# Altium project DARKYDEN.PrjPcb (part 6 of 15)

## Sheet POWER_PCie.SchDoc: DARKYDEN_POWERPCie
size Letter; ApprovedBy: APPROUVÉ PAR; Author: Harold Malbrouck; Organization: Cegep Limoilou; Address1: 1300, 8e Avenue; Address2: Québec, QC; Address3: Canada; Address4: G1J 5L5; Revision: Rev.A; SheetNumber: 6; SheetTotal: 22
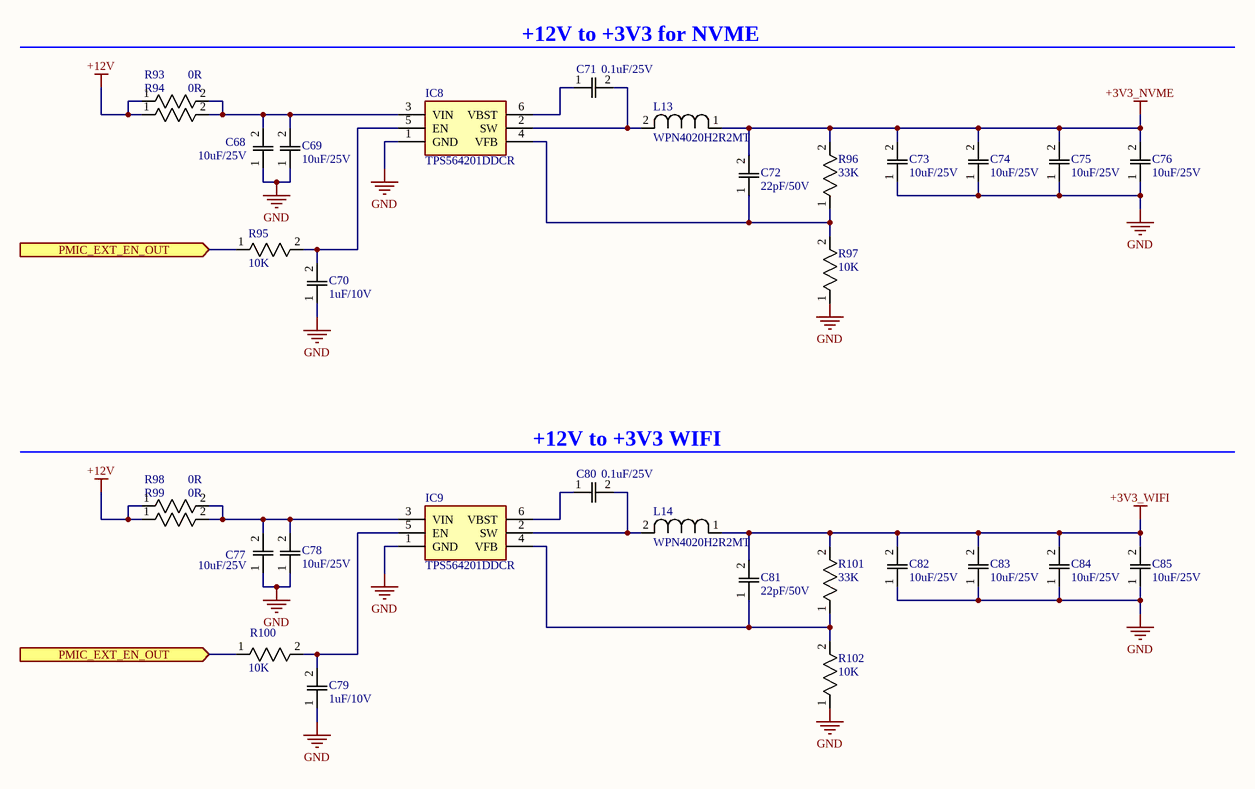
[diagram p5: POWER_PCie.SchDoc]

### Parts
C68  10uF/25V  [CAPC220145_88N_KEM]
C69  10uF/25V  [CAPC220145_88N_KEM]
C70  1uF/10V  [CAPC220145_88N_KEM]
C71  0.1uF/25V  [CAPC220145_88N_KEM]
C72  22pF/50V  [CAPC220145_88N_KEM]
C73  10uF/25V  [CAPC220145_88N_KEM]
C74  10uF/25V  [CAPC220145_88N_KEM]
C75  10uF/25V  [CAPC220145_88N_KEM]
C76  10uF/25V  [CAPC220145_88N_KEM]
C77  10uF/25V  [CAPC220145_88N_KEM]
C78  10uF/25V  [CAPC220145_88N_KEM]
C79  1uF/10V  [CAPC220145_88N_KEM]
C80  0.1uF/25V  [CAPC220145_88N_KEM]
C81  22pF/50V  [CAPC220145_88N_KEM]
C82  10uF/25V  [CAPC220145_88N_KEM]
C83  10uF/25V  [CAPC220145_88N_KEM]
C84  10uF/25V  [CAPC220145_88N_KEM]
C85  10uF/25V  [CAPC220145_88N_KEM]
IC8  TPS564201DDCR  [SOT95P280X110-6N]
IC9  TPS564201DDCR  [SOT95P280X110-6N]
L13  WPN4020H2R2MT  [IND_WPN4020H_SNL]
L14  WPN4020H2R2MT  [IND_WPN4020H_SNL]
R93  0R  [ERJ3EKF1000V]
R94  0R  [ERJ3EKF1000V]
R95  10K  [ERJ3EKF1000V]
R96  33K  [ERJ3EKF1000V]
R97  10K  [ERJ3EKF1000V]
R98  0R  [ERJ3EKF1000V]
R99  0R  [ERJ3EKF1000V]
R100  10K  [ERJ3EKF1000V]
R101  33K  [ERJ3EKF1000V]
R102  10K  [ERJ3EKF1000V]

### Ports
PMIC_EXT_EN_OUT (in, see CONNECTEUR_1[1B], Power[1A], Power[1C], POWER_PCie[1B]), PMIC_EXT_EN_OUT (in, see CONNECTEUR_1[1B], Power[1A], Power[1C], POWER_PCie[1C])

### Nets
+3V3_NVME: C72.2 C73.2 C74.2 C75.2 C76.2 L13.1 R96.2
+3V3_WIFI: C81.2 C82.2 C83.2 C84.2 C85.2 L14.1 R101.2
+12V: R93.1 R94.1 R98.1 R99.1  [project net Vout]
GND: C68.1 C69.1 C70.1 C73.1 C74.1 C75.1 C76.1 C77.1 C78.1 C79.1 C82.1 C83.1 C84.1 C85.1 IC8.1(GND) IC9.1(GND) R97.1 R102.1  [project net PACK-]
PMIC_EXT_EN_OUT: R95.1 R100.1 ; port PMIC_EXT_EN_OUT
NetC68_2: C68.2 C69.2 IC8.3(VIN) R93.2 R94.2
NetC70_2: C70.2 IC8.5(EN) R95.2
NetC71_1: C71.1 IC8.6(VBST)
NetC71_2: C71.2 IC8.2(SW) L13.2
NetC72_1: C72.1 IC8.4(VFB) R96.1 R97.2
NetC77_2: C77.2 C78.2 IC9.3(VIN) R98.2 R99.2
NetC79_2: C79.2 IC9.5(EN) R100.2
NetC80_1: C80.1 IC9.6(VBST)
NetC80_2: C80.2 IC9.2(SW) L14.2
NetC81_1: C81.1 IC9.4(VFB) R101.1 R102.2

### Notes on the sheet
- (near C71) +12V to +3V3 for NVME
- (near C80) +12V to +3V3 WIFI
- Titre :
- Conception :
- Date :
- Approbation :
- Heure :
- Révision :
- Feuille
- de
- Fichier :

### Library data of the parts
C68 C69 C73-C78 C82-C85 = C0805C106K3PACTU: 10uF / 25 VDC, +85degC, X5R Dielec, +/-10% | KEMET C0805C106K3PACTU 0805; Dielectric Material: Ceramic; Material: 4241ConductorMaterial; Voltage Rating: 25V; Dissipation Factor: 10%; Mfr_Name: Kemet; Supplier: Digikey; Supplier Part Number: 399-11939-1-ND; Manufacturer: KEMET; Manufacturer Part Number: C0805C106K3PACTU; RoHS: Yes; Category: Ceramic Capacitors; Case/Package: 0805; Case Code (Metric): 2012; Case Code (Imperial): 0805; Min Operating Temperature: -55°C; Max Operating Temperature: 85°C; Dielectric: X5R; Packaging: Cut Tape; Voltage: 25V; Termination: Solder; Tolerance: 10%; Value: 10uF; Series: SMD Comm X5R; Voltage Rating (DC): 25V; Length: 2mm; Height: 1.25mm; Depth: 1.25mm; Reach SVHC Compliant: No; RoHS Compliant: Yes; Lead Free: 5697LeadFree; ComponentLink1URL: http://www.farnell.com/datasheets/2741185.pdf?src-supplier=Farnell; ComponentLink1Description: http://www.farnell.com/datasheets/2741185.pdf?src-supplier=Farnell; ComponentLink2URL: http://www.alliedelec.com/m/d/f3c02ddb98afa3dd1adcb801109671e9.pdf?src-supplier=Allied+Electronics; ComponentLink2Description: http://www.alliedelec.com/m/d/f3c02ddb98afa3dd1adcb801109671e9.pdf?src-supplier=Allied+Electronics; ComponentLink3URL: https://api.kemet.com/component-edge/download/datasheet/C0805C106K3PAC7800.pdf?src-supplier=Digikey; ComponentLink3Description: https://api.kemet.com/component-edge/download/datasheet/C0805C106K3PAC7800.pdf?src-supplier=Digikey; ComponentLink4URL: http://www.kemet.com/Lists/ProductCatalog/Attachments/19/KEM_C1006_X5R_SMD.pdf?src-supplier=Avnet; ComponentLink4Description: http://www.kemet.com/Lists/ProductCatalog/Attachments/19/KEM_C1006_X5R_SMD.pdf?src-supplier=Avnet; ComponentLink5URL: http://www.farnell.com/datasheets/2741185.pdf?src-supplier=Element14; ComponentLink5Description: http://www.farnell.com/datasheets/2741185.pdf?src-supplier=Element14; ComponentLink6URL: http://www.farnell.com/datasheets/2741185.pdf?src-supplier=Newark; ComponentLink6Description: http://www.farnell.com/datasheets/2741185.pdf?src-supplier=Newark; ComponentLink7URL: https://datasheet.octopart.com/C0805C106K3PACTU-Kemet-datasheet-46909776.pdf?src-supplier=Element14; ComponentLink7Description: https://datasheet.octopart.com/C0805C106K3PACTU-Kemet-datasheet-46909776.pdf?src-supplier=Element14
C70 C79 = C0805C105K8RACTU: Multilayer Ceramic Capacitors MLCC - SMD/SMT 10V 1uF X7R 0805 10%; Mfr_Name: Kemet; Material: 4241ConductorMaterial; Dissipation Factor: 5%; Supplier: Digikey; Supplier Part Number: 399-C0805C105K8RACTUCT-ND; Manufacturer: KEMET; Manufacturer Part Number: C0805C105K8RACTU; RoHS: Yes; Category: Ceramic Capacitors; Stock: 113387; Pricing: 1=0.2, 10=0.112, 100=0.0701, 1000=0.04837 (USD); Mounting Technology: Surface Mount; Case/Package: 0805; Pins: 2NUMBER; Case Code (Imperial): 0805; Case Code (Metric): 2012; Dielectric Material: Ceramic; Min Operating Temperature: -55°C; Max Operating Temperature: 125°C; Packaging: Tape and Reel; Tolerance: 10%; Value: 1uF; Dielectric: X7R; Package Quantity: 1; Voltage Rating: 10V; Voltage Rating (DC): 10V; Termination: SMD/SMT; Voltage: 10V; Series: C; Construction: Flat; Length: 2mm; Width: 0.049inch; Height: 0.9mm; Depth: 1.25mm; Thickness: 0.039inch; Lead Pitch: 0.75mm; Radiation Hardening: No; Reach SVHC Compliant: No; RoHS Compliant: Yes; Lead Free: 5697LeadFree; ComponentLink1URL: https://datasheet.ciiva.com/6074/kem-c1002-x7r-smd-6074662.pdf?src-supplier=Farnell; ComponentLink1Description: https://datasheet.ciiva.com/6074/kem-c1002-x7r-smd-6074662.pdf?src-supplier=Farnell; ComponentLink2URL: https://datasheet.ciiva.com/22749/1918693-22749723.pdf?src-supplier=Element14; ComponentLink2Description: https://datasheet.ciiva.com/22749/1918693-22749723.pdf?src-supplier=Element14; ComponentLink3URL: https://datasheet.ciiva.com/46385/1851736-46385656.pdf?src-supplier=Element14; ComponentLink3Description: https://datasheet.ciiva.com/46385/1851736-46385656.pdf?src-supplier=Element14; ComponentLink4URL: https://datasheet.ciiva.com/46443/1851736-46443534.pdf?src-supplier=Element14; ComponentLink4Description: https://datasheet.ciiva.com/46443/1851736-46443534.pdf?src-supplier=Element14
C71 C80 = C0805C104K3RACTU: 0.1uF 25V X7R 10% SMD 0805 125C Plastic T/R; Mfr_Name: Kemet; Material: 4241ConductorMaterial; Value: 100nF; Temperature Coefficient: 30ppm/°C; Supplier: Digikey; Supplier Part Number: 399-C0805C104K3RACTUCT-ND; Manufacturer: KEMET; Manufacturer Part Number: C0805C104K3RACTU; RoHS: Yes; Category: Ceramic Capacitors; Mounting Technology: Surface Mount,PCB; Case/Package: 0805; Pins: 2NUMBER; Case Code (Imperial): 0805; Case Code (Metric): 2012; Min Operating Temperature: -55°C; Max Operating Temperature: 125°C; Packaging: Tape and Reel; Tolerance: 10%; Dielectric: X7R; Termination: SMD/SMT; Package Quantity: 4000; Voltage Rating: 25V; Series: SMD Comm X7R; Voltage Rating (DC): 25V; Construction: Flat; Length: 2mm; Width: 1.2mm; Height: 0.9mm; Depth: 1.25mm; Lead Pitch: 0.75mm; Thickness: 889um; Radiation Hardening: No; RoHS Compliant: Yes; Lead Free: 5697LeadFree; Reach SVHC Compliant: 4186SVHC; ComponentLink1URL: https://datasheet.ciiva.com/7842/kem-c1002-x7r-smd-7842536.pdf?src-supplier=Element14; ComponentLink1Description: https://datasheet.ciiva.com/7842/kem-c1002-x7r-smd-7842536.pdf?src-supplier=Element14; ComponentLink2URL: https://datasheet.ciiva.com/7842/kem-c1002-x7r-smd-7842538.pdf?src-supplier=Element14; ComponentLink2Description: https://datasheet.ciiva.com/7842/kem-c1002-x7r-smd-7842538.pdf?src-supplier=Element14
C72 C81 = C0805C220J5RACTU: Cap Ceramic 22pF 50V X7R 5% Pad SMD 0805 125°C T/R; Mfr_Name: Kemet; Temperature Coefficient: 30ppm/°C; Supplier: Digikey; Supplier Part Number: 399-17625-1-ND; Manufacturer: KEMET; Manufacturer Part Number: C0805C220J5RACTU; RoHS: Yes; Category: Ceramic Capacitors; Stock: 8069; Pricing: 1=0.13, 10=0.072, 100=0.0434, 1000=0.02906 (USD); Case/Package: 0805; Material: Ceramic; Dielectric Material: Ceramic; Min Operating Temperature: -55°C; Max Operating Temperature: 125°C; Value: 22pF; Dielectric: X7R; Voltage Rating: 50V; Voltage Rating (DC): 50V; Height: 880um; RoHS Compliant: Yes; ComponentLink1URL: https://datasheet.octopart.com/C0805C220J5RACTU-KEMET-datasheet-130256537.pdf?src-supplier=Farnell; ComponentLink1Description: https://datasheet.octopart.com/C0805C220J5RACTU-KEMET-datasheet-130256537.pdf?src-supplier=Farnell; ComponentLink2URL: https://datasheet.octopart.com/C0805C220J5RACTU-KEMET-datasheet-170333836.pdf?src-supplier=Newark; ComponentLink2Description: https://datasheet.octopart.com/C0805C220J5RACTU-KEMET-datasheet-170333836.pdf?src-supplier=Newark
IC8 IC9 = TPS564201DDCR: IC REG BUCK ADJ 4A SOT23 "Buck Switching Regulator IC Positive Adjustable 0.76V 1 Output 4A SOT-23-6 Thin, TSOT-23-6"; Manufacturer_Name: Texas Instruments; Number of Outputs: 1; Min Input Voltage: 4.5V; Max Supply Voltage: 17V; Min Output Voltage: 760mV; Max Output Voltage: 7V; Switching Frequency: 560kHz; Synchronous Rectifier: Yes; Quiescent Current: 400uA; Datasheet Link: http://www.ti.com/lit/gpn/tps564201; Height: 1.1mm; Manufacturer_Part_Number: TPS564201DDCR; Mouser Part Number: 595-TPS564201DDCR; Mouser Price/Stock: https://www.mouser.co.uk/ProductDetail/Texas-Instruments/TPS564201DDCR?qs=zEmsApcVOkUKQpyzRnH%2FcQ%3D%3D; Arrow Part Number: TPS564201DDCR; Arrow Price/Stock: https://www.arrow.com/en/products/tps564201ddcr/texas-instruments?region=nac; Supplier: Digikey; Supplier Part Number: 296-47373-1-ND; Manufacturer: Texas Instruments; Manufacturer Part Number: TPS564201DDCR; RoHS: Yes; Category: Voltage Regulators - Switching; Mounting Technology: Surface Mount; Case/Package: SOT-23-6; Pins: 6; Min Operating Temperature: -40°C; Max Operating Temperature: 125°C; Packaging: Cut Tape; Output Current: 4A; Output Type: Adjustable; Output Configuration: Positive; Series: D-CAP2™; Number of Channels: 1; Length: 2.9mm; Width: 1.6mm; Thickness: 870um; Lead Free: Lead Free; RoHS Compliant: Yes; ComponentLink1URL: http://www.ti.com/lit/ds/symlink/tps564201.pdf?src-supplier=Digikey; ComponentLink1Description: http://www.ti.com/lit/ds/symlink/tps564201.pdf?src-supplier=Digikey; ComponentLink2URL: http://www.ti.com/general/docs/suppproductinfo.tsp?distId=10&amp;gotoUrl=http%3A%2F%2Fwww.ti.com%2Flit%2Fgpn%2Ftps564201&src-supplier=Digikey; ComponentLink2Description: http://www.ti.com/general/docs/suppproductinfo.tsp?distId=10&amp;gotoUrl=http%3A%2F%2Fwww.ti.com%2Flit%2Fgpn%2Ftps564201&src-supplier=Digikey
L13 L14 = WPN4020H2R2MT: 2.2 µH Shielded Drum Core, Wirewound Inductor 4.3 A 48mOhm Max Nonstandard; Mfr_Name: Sunlord; Type: Fixed Inductors; Supplier: Digikey; Supplier Part Number: 3442-WPN4020H2R2MTCT-ND; Manufacturer: Sunlord; Manufacturer Part Number: WPN4020H2R2MT; RoHS: No; Category: Fixed Inductors
R93 R94 R98 R99 = ERJ-3GEY0R00V: Zero Ohm Resistor, Jumper, 0603 [1608 Metric], Thick Film, 100 mW, 1 A, Surface Mount; Manufacturer_Name: Panasonic; Power Rating: 100mW; Voltage Rating: 75V; Tolerance: 0%; Temperature Coefficient: 200ppm/°C; Datasheet Link: http://docs-europe.electrocomponents.com/webdocs/13ba/0900766b813ba21b.pdf; Height: 0.55mm; Manufacturer_Part_Number: ERJ-3GEY0R00V; Mouser Part Number: 667-ERJ-3GEY0R00V; Mouser Price/Stock: https://www.mouser.co.uk/ProductDetail/Panasonic/ERJ-3GEY0R00V?qs=66DK8nO8gJALIOqOWgiVwg%3D%3D; Arrow Part Number: ERJ-3GEY0R00V; Arrow Price/Stock: https://www.arrow.com/en/products/erj3gey0r00v/panasonic?region=europe; Supplier: Digikey; Supplier Part Number: P0.0GCT-ND; Manufacturer: Panasonic; Manufacturer Part Number: ERJ-3GEY0R00V; RoHS: Yes; Category: Chip SMD Resistors; Stock: 766631; Pricing: 1=0.1, 10=0.02, 25=0.0164, 50=0.0144, 100=0.0126, 250=0.0106, 500=0.00936, 1000=0.0083 (USD); Mounting Technology: Surface Mount; Case/Package: 0603; Case Code (Metric): 1608; Case Code (Imperial): 0603; Contact Plating: Tin; Min Operating Temperature: -55°C; Max Operating Temperature: 155°C; Packaging: Tape and Reel; Package Quantity: 5000; Value: 0R; Resistor Type: Thick Film; Number of Terminations: 2; Termination: SMD/SMT; Max Power Dissipation: 100mW; Features: Automotive AEC-Q200; Series: ERJ; Construction: Rectangular; Technology: THICK FILM; Length: 1.6mm; Width: 0.8mm; Depth: 0.8mm; Ratings: AEC-Q200; Radiation Hardening: No; Reach SVHC Compliant: No; Military Standard: Not; RoHS Compliant: Yes; Lead Free: 5697LeadFree; ComponentLink1URL: https://datasheet.ciiva.com/11808/0900766b80f806dd-11808207.pdf?src-supplier=Rs; ComponentLink1Description: https://datasheet.ciiva.com/11808/0900766b80f806dd-11808207.pdf?src-supplier=Rs; ComponentLink2URL: https://datasheet.ciiva.com/27055/1935748-27055113.pdf?src-supplier=Jameco; ComponentLink2Description: https://datasheet.ciiva.com/27055/1935748-27055113.pdf?src-supplier=Jameco; ComponentLink3URL: https://datasheet.ciiva.com/5959/1678796-5959707.pdf?src-supplier=Farnell; ComponentLink3Description: https://datasheet.ciiva.com/5959/1678796-5959707.pdf?src-supplier=Farnell; ComponentLink4URL: https://datasheet.ciiva.com/43460/1678796-43460647.pdf?src-supplier=Farnell; ComponentLink4Description: https://datasheet.ciiva.com/43460/1678796-43460647.pdf?src-supplier=Farnell; ComponentLink5URL: https://datasheet.ciiva.com/48532/aoa0000ce1-48532165.pdf?src-supplier=Avnet; ComponentLink5Description: https://datasheet.ciiva.com/48532/aoa0000ce1-48532165.pdf?src-supplier=Avnet; ComponentLink6URL: https://datasheet.ciiva.com/28695/1678796-28695833.pdf?src-supplier=Element14; ComponentLink6Description: https://datasheet.ciiva.com/28695/1678796-28695833.pdf?src-supplier=Element14; ComponentLink7URL: https://datasheet.ciiva.com/16834/aoa0000ce1-16834828.pdf?src-supplier=Future+Electronics; ComponentLink7Description: https://datasheet.ciiva.com/16834/aoa0000ce1-16834828.pdf?src-supplier=Future+Electronics; ComponentLink8URL: https://datasheet.ciiva.com/16758/70255313-16758527.pdf?src-supplier=Allied+Electronics; ComponentLink8Description: https://datasheet.ciiva.com/16758/70255313-16758527.pdf?src-supplier=Allied+Electronics; ComponentLink9URL: https://datasheet.ciiva.com/30199/4aoa0000ce1-30199822.pdf?src-supplier=Onlinecomponents.com; ComponentLink9Description: https://datasheet.ciiva.com/30199/4aoa0000ce1-30199822.pdf?src-supplier=Onlinecomponents.com; ComponentLink10URL: https://datasheet.ciiva.com/46377/1678796-46377868.pdf?src-supplier=Element14; ComponentLink10Description: https://datasheet.ciiva.com/46377/1678796-46377868.pdf?src-supplier=Element14; ComponentLink11URL: https://datasheet.ciiva.com/9198/aoa0000ce1-9198975.pdf?src-supplier=Avnet; ComponentLink11Description: https://datasheet.ciiva.com/9198/aoa0000ce1-9198975.pdf?src-supplier=Avnet
R95 R97 R100 R102 = ERJ-3GEYJ103V: 10K Ohm 5% Res Thick Film 0603  0.1W(1/10W) ±200ppm/C Pad SMD Automotive T/R; Manufacturer_Name: Panasonic; Value: 10kR; Temperature Coefficient: 200ppm/°C; Power Rating: 100mW; Voltage Rating: 75V; Datasheet Link: http://docs-europe.electrocomponents.com/webdocs/13ba/0900766b813ba21b.pdf; Height: 0.55mm; Manufacturer_Part_Number: ERJ-3GEYJ103V; Mouser Part Number: 667-ERJ-3GEYJ103V; Mouser Price/Stock: https://www.mouser.co.uk/ProductDetail/Panasonic/ERJ-3GEYJ103V?qs=66DK8nO8gJBWgc%252B0VNNxzg%3D%3D; Arrow Part Number: ERJ-3GEYJ103V; Arrow Price/Stock: https://www.arrow.com/en/products/erj-3geyj103v/panasonic?region=europe; Supplier: Digikey; Supplier Part Number: P10KGCT-ND; Manufacturer: Panasonic; Manufacturer Part Number: ERJ-3GEYJ103V; RoHS: Yes; Category: Chip SMD Resistors; Stock: 2191587; Pricing: 1=0.1, 10=0.033, 50=0.02, 100=0.0165, 500=0.01096, 1000=0.00939 (USD); Mounting Technology: Surface Mount; Case/Package: 0603; Case Code (Imperial): 0603; Case Code (Metric): 1608; Weight: 7.1E-05oz; Contact Plating: Tin; Min Operating Temperature: -55°C; Max Operating Temperature: 155°C; Tolerance: 5%; Packaging: Tape and Reel; Technology: THICK FILM; Package Quantity: 1; Resistor Type: Thick Film; Termination: SMD/SMT; Number of Terminations: 2; Max Power Dissipation: 100mW; Working Voltage: 75V; Features: Automotive AEC-Q200; Series: ERJ; Construction: Rectangular; Resistance Tolerance: 5%; Length: 1.6mm; Width: 0.8mm; Depth: 0.8mm; Reach SVHC Compliant: No; Military Standard: Not; Lead Free: Lead Free; RoHS Compliant: Yes; ComponentLink1URL: https://datasheet.ciiva.com/11809/0900766b80f806dd-11809566.pdf?src-supplier=Rs; ComponentLink1Description: https://datasheet.ciiva.com/11809/0900766b80f806dd-11809566.pdf?src-supplier=Rs; ComponentLink2URL: https://datasheet.ciiva.com/34303/2007265-34303757.pdf?src-supplier=Jameco; ComponentLink2Description: https://datasheet.ciiva.com/34303/2007265-34303757.pdf?src-supplier=Jameco; ComponentLink3URL: https://datasheet.ciiva.com/48531/aoa0000ce1-48531887.pdf?src-supplier=Avnet; ComponentLink3Description: https://datasheet.ciiva.com/48531/aoa0000ce1-48531887.pdf?src-supplier=Avnet; ComponentLink4URL: https://datasheet.ciiva.com/9117/aoa0000ce1-9117038.pdf?src-supplier=Avnet; ComponentLink4Description: https://datasheet.ciiva.com/9117/aoa0000ce1-9117038.pdf?src-supplier=Avnet; ComponentLink5URL: https://datasheet.ciiva.com/28514/1678796-28514213.pdf?src-supplier=Element14; ComponentLink5Description: https://datasheet.ciiva.com/28514/1678796-28514213.pdf?src-supplier=Element14; ComponentLink6URL: https://datasheet.ciiva.com/46371/1678796-46371909.pdf?src-supplier=Element14; ComponentLink6Description: https://datasheet.ciiva.com/46371/1678796-46371909.pdf?src-supplier=Element14; ComponentLink7URL: https://datasheet.ciiva.com/46385/1678796-46385240.pdf?src-supplier=Element14; ComponentLink7Description: https://datasheet.ciiva.com/46385/1678796-46385240.pdf?src-supplier=Element14; ComponentLink8URL: https://datasheet.ciiva.com/24133/aoa0000ce1-37422-24133064.pdf?src-supplier=Mouser; ComponentLink8Description: https://datasheet.ciiva.com/24133/aoa0000ce1-37422-24133064.pdf?src-supplier=Mouser; ComponentLink9URL: https://datasheet.ciiva.com/16740/aoa0000ce1-16740655.pdf?src-supplier=Future+Electronics; ComponentLink9Description: https://datasheet.ciiva.com/16740/aoa0000ce1-16740655.pdf?src-supplier=Future+Electronics; ComponentLink10URL: https://datasheet.ciiva.com/30147/4aoa0000ce1-30147029.pdf?src-supplier=Onlinecomponents.com; ComponentLink10Description: https://datasheet.ciiva.com/30147/4aoa0000ce1-30147029.pdf?src-supplier=Onlinecomponents.com
R96 R101 = ERJ-3GEYJ333V: 33K Ohm 0603  5% 0.1W(1/10W) +/-200ppm/ßC SMD Automotive T/R; Manufacturer_Name: Panasonic; Value: 33kR; Power Rating: 100mW; Voltage Rating: 75V; Temperature Coefficient: 200ppm/°C; Datasheet Link: http://docs-europe.electrocomponents.com/webdocs/13ba/0900766b813ba21b.pdf; Height: 0.55mm; Manufacturer_Part_Number: ERJ-3GEYJ333V; Mouser Part Number: 667-ERJ-3GEYJ333V; Mouser Price/Stock: https://www.mouser.co.uk/ProductDetail/Panasonic/ERJ-3GEYJ333V?qs=JjxTDIFmKPQB8Hd2hIsG7w%3D%3D; Supplier: Avnet; Supplier Part Number: 65T8631; Manufacturer: Panasonic; Manufacturer Part Number: ERJ-3GEYJ333V; RoHS: Yes; Category: Chip SMD Resistors; Mounting Technology: Surface Mount; Case/Package: 0603; Case Code (Metric): 1608; Case Code (Imperial): 0603; Contact Plating: Tin; Min Operating Temperature: -55°C; Max Operating Temperature: 155°C; Tolerance: 5%; Packaging: Tape and Reel; Package Quantity: 1; Resistor Type: Thick Film; Number of Terminations: 2; Termination: SMD/SMT; Max Power Dissipation: 100mW; Features: Automotive AEC-Q200; Series: ERJ; Construction: Rectangular; Technology: THICK FILM; Resistance Tolerance: 5%; Length: 1.6mm; Width: 0.8mm; Depth: 0.8mm; Radiation Hardening: No; Reach SVHC Compliant: No; Military Standard: Not; Lead Free: Lead Free; RoHS Compliant: Yes; ComponentLink1URL: https://datasheet.ciiva.com/11821/0900766b80f806dd-11821443.pdf?src-supplier=Rs; ComponentLink1Description: https://datasheet.ciiva.com/11821/0900766b80f806dd-11821443.pdf?src-supplier=Rs; ComponentLink2URL: https://datasheet.ciiva.com/6082/1500035-6082201.pdf?src-supplier=Farnell; ComponentLink2Description: https://datasheet.ciiva.com/6082/1500035-6082201.pdf?src-supplier=Farnell; ComponentLink3URL: https://datasheet.ciiva.com/43460/1500035-43460750.pdf?src-supplier=Farnell; ComponentLink3Description: https://datasheet.ciiva.com/43460/1500035-43460750.pdf?src-supplier=Farnell; ComponentLink4URL: https://datasheet.ciiva.com/9117/aoa0000ce1-9117178.pdf?src-supplier=Avnet; ComponentLink4Description: https://datasheet.ciiva.com/9117/aoa0000ce1-9117178.pdf?src-supplier=Avnet; ComponentLink5URL: https://datasheet.ciiva.com/16788/70255313-16788733.pdf?src-supplier=Allied+Electronics; ComponentLink5Description: https://datasheet.ciiva.com/16788/70255313-16788733.pdf?src-supplier=Allied+Electronics; ComponentLink6URL: https://datasheet.ciiva.com/30068/4aoa0000ce1-30068957.pdf?src-supplier=Onlinecomponents.com; ComponentLink6Description: https://datasheet.ciiva.com/30068/4aoa0000ce1-30068957.pdf?src-supplier=Onlinecomponents.com; ComponentLink7URL: https://datasheet.ciiva.com/16765/70255313-16765226.pdf?src-supplier=Allied+Electronics; ComponentLink7Description: https://datasheet.ciiva.com/16765/70255313-16765226.pdf?src-supplier=Allied+Electronics; ComponentLink8URL: https://datasheet.ciiva.com/28682/1678796-28682159.pdf?src-supplier=Element14; ComponentLink8Description: https://datasheet.ciiva.com/28682/1678796-28682159.pdf?src-supplier=Element14; ComponentLink9URL: https://datasheet.ciiva.com/46377/1500035-46377061.pdf?src-supplier=Element14; ComponentLink9Description: https://datasheet.ciiva.com/46377/1500035-46377061.pdf?src-supplier=Element14; ComponentLink10URL: https://datasheet.ciiva.com/46388/1500035-46388634.pdf?src-supplier=Element14; ComponentLink10Description: https://datasheet.ciiva.com/46388/1500035-46388634.pdf?src-supplier=Element14

## Sheet SDCARD.SchDoc: DARKYDEN_SDCARD
size Letter; ApprovedBy: APPROUVÉ PAR; Author: Harold Malbrouck; Organization: Cegep Limoilou; Address1: 1300, 8e Avenue; Address2: Québec, QC; Address3: Canada; Address4: G1J 5L5; Revision: Rev.A; SheetNumber: 7; SheetTotal: 22
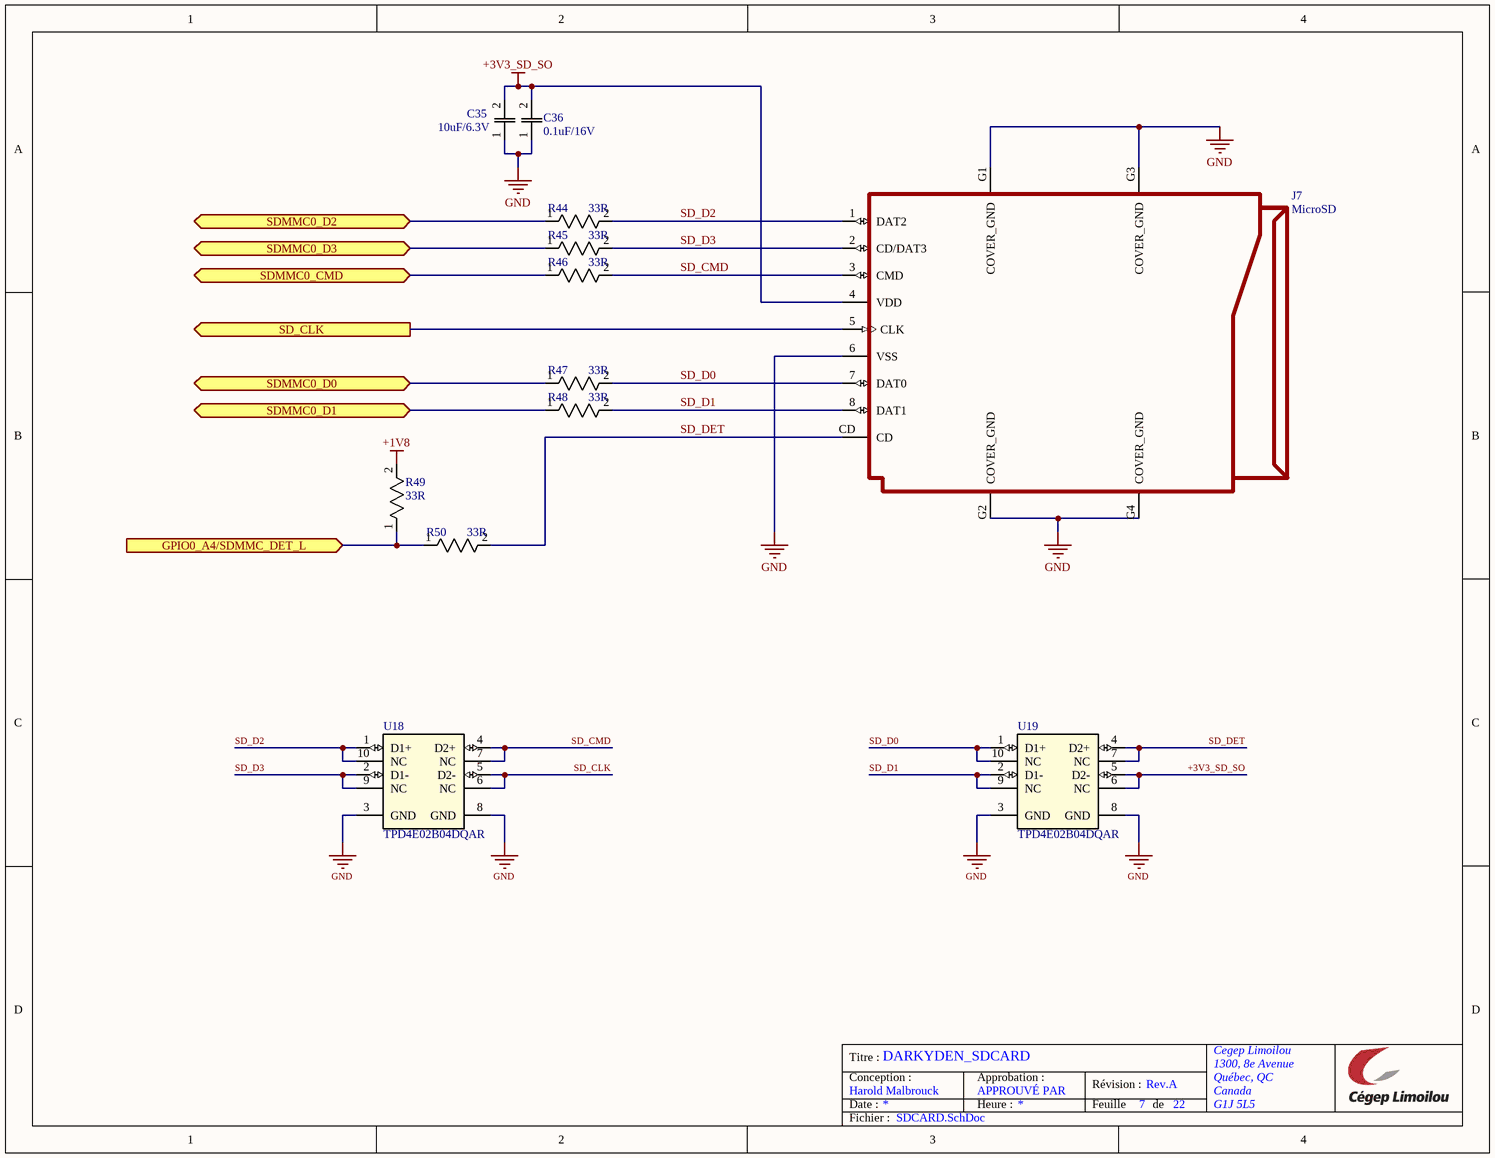
[diagram p6: SDCARD.SchDoc]

### Parts
C35  10uF/6.3V  [C0805]
C36  0.1uF/16V  [CAPC220145_88N_KEM]
J7  MicroSD  [CUI_MSD-4-A]
R44  33R  [RC0603N_PAN]
R45  33R  [RC0603N_PAN]
R46  33R  [RC0603N_PAN]
R47  33R  [RC0603N_PAN]
R48  33R  [RC0603N_PAN]
R49  33R  [RC0603N_PAN]
R50  33R  [RC0603N_PAN]
U18  TPD4E02B04DQAR  [DQA0010A]
U19  TPD4E02B04DQAR  [DQA0010A]

### Ports
GPIO0_A4/SDMMC_DET_L (in, see CONNECTEUR_4[3C]), SD_CLK (out, see CONNECTEUR_4[3B]), SDMMC0_CMD (bidir, see CONNECTEUR_4[3B]), SDMMC0_D0 (bidir, see CONNECTEUR_4[3B]), SDMMC0_D1 (bidir, see CONNECTEUR_4[3B]), SDMMC0_D2 (bidir, see CONNECTEUR_4[3B]), SDMMC0_D3 (bidir, see CONNECTEUR_4[3B])

### Nets
+1V8: R49.2
+3V3_SD_SO: C35.2 C36.2 J7.4(VDD) U19.5(D2-) U19.6(NC)
GND: C35.1 C36.1 J7.6(VSS) J7.G1(COVER_GND) J7.G2(COVER_GND) J7.G3(COVER_GND) J7.G4(COVER_GND) U18.3(GND) U18.8(GND) U19.3(GND) U19.8(GND)  [project net PACK-]
GPIO0_A4/SDMMC_DET_L: R49.1 R50.1 ; port GPIO0_A4/SDMMC_DET_L
SD_CLK: J7.5(CLK) ; port SD_CLK
SD_CLK: U18.5(D2-) U18.6(NC)  [a separate net that carries the same name]
SD_CMD: J7.3(CMD) R46.2 U18.4(D2+) U18.7(NC)
SD_D0: J7.7(DAT0) R47.2 U19.1(D1+) U19.10(NC)
SD_D1: J7.8(DAT1) R48.2 U19.2(D1-) U19.9(NC)
SD_D2: J7.1(DAT2) R44.2 U18.1(D1+) U18.10(NC)
SD_D3: J7.2(CD/DAT3) R45.2 U18.2(D1-) U18.9(NC)
SD_DET: J7.CD R50.2 U19.4(D2+) U19.7(NC)
SDMMC0_CMD: R46.1 ; port SDMMC0_CMD
SDMMC0_D0: R47.1 ; port SDMMC0_D0
SDMMC0_D1: R48.1 ; port SDMMC0_D1
SDMMC0_D2: R44.1 ; port SDMMC0_D2
SDMMC0_D3: R45.1 ; port SDMMC0_D3

### Notes on the sheet
- Titre :
- Conception :
- Date :
- Approbation :
- Heure :
- Révision :
- Feuille
- de
- Fichier :

### Library data of the parts
C35 = C0805C106K9RACTU: 10uF/6.3V SMD Comm X7R 0805 (2012Metric) Ceramic Capacitor 0.079Lx0.049W 2.00mmx1.25mm X7R ±10% 10muF; Manufacturer_Name: KEMET; Material: 4241ConductorMaterial; Value: 10uF; Voltage Rating: 6.3V; Dissipation Factor: 7.5%; Datasheet Link: https://content.kemet.com/datasheets/KEM_C1002_X7R_SMD.pdf; Height: 1.1mm; Manufacturer_Part_Number: C0805C106K9RACTU; Mouser Part Number: 80-C0805C106K9R; Mouser Price/Stock: https://www.mouser.co.uk/ProductDetail/KEMET/C0805C106K9RACTU?qs=iP0bYSAMAFo3iKcrfaqAag%3D%3D; Arrow Part Number: C0805C106K9RACTU; Arrow Price/Stock: https://www.arrow.com/en/products/c0805c106k9ractu/kemet-corporation?region=nac; Supplier: Digikey; Supplier Part Number: 399-C0805C106K9RACTUCT-ND; Manufacturer: KEMET; Manufacturer Part Number: C0805C106K9RACTU; RoHS: Yes; Category: Ceramic Capacitors; Stock: 12575; Pricing: 1=0.34, 10=0.203, 100=0.1327, 1000=0.0974 (USD); Mounting Technology: Surface Mount; Case/Package: 0805; Case Code (Metric): 2012; Case Code (Imperial): 0805; Dielectric Material: Ceramic; Min Operating Temperature: -55°C; Max Operating Temperature: 125°C; Package Quantity: 1; Tolerance: 10%; Packaging: Tape and Reel; Voltage Rating (DC): 6.3V; Dielectric: X7R; Termination: SMD/SMT; Series: C; Length: 2mm; Width: 0.049inch; Thickness: 0.055inch; Depth: 1.25mm; Reach SVHC Compliant: No; RoHS Compliant: Yes; ComponentLink1URL: http://www.farnell.com/datasheets/2745931.pdf?src-supplier=Farnell; ComponentLink1Description: http://www.farnell.com/datasheets/2745931.pdf?src-supplier=Farnell; ComponentLink2URL: http://www.mouser.com/ds/2/212/KEM_C1002_X7R_SMD-1102033.pdf?src-supplier=Mouser; ComponentLink2Description: http://www.mouser.com/ds/2/212/KEM_C1002_X7R_SMD-1102033.pdf?src-supplier=Mouser; ComponentLink3URL: http://datasheet.octopart.com/C0805C106K9RACTU-KEMET-datasheet-157246124.pdf?src-supplier=Avnet; ComponentLink3Description: http://datasheet.octopart.com/C0805C106K9RACTU-KEMET-datasheet-157246124.pdf?src-supplier=Avnet; ComponentLink4URL: http://datasheet.octopart.com/C0805C106K9RACTU-KEMET-datasheet-157246124.pdf?src-supplier=Verical; ComponentLink4Description: http://datasheet.octopart.com/C0805C106K9RACTU-KEMET-datasheet-157246124.pdf?src-supplier=Verical; ComponentLink5URL: http://datasheet.octopart.com/C0805C106K9RACTU-KEMET-datasheet-157246124.pdf?src-supplier=Onlinecomponents.com; ComponentLink5Description: http://datasheet.octopart.com/C0805C106K9RACTU-KEMET-datasheet-157246124.pdf?src-supplier=Onlinecomponents.com; ComponentLink6URL: http://components.arrow.com/part/dataview/53801129S170069N7429?src-supplier=Arrow+Electronics; ComponentLink6Description: http://components.arrow.com/part/dataview/53801129S170069N7429?src-supplier=Arrow+Electronics; ComponentLink7URL: http://www.farnell.com/datasheets/1828800.pdf?src-supplier=Newark; ComponentLink7Description: http://www.farnell.com/datasheets/1828800.pdf?src-supplier=Newark; ComponentLink8URL: http://datasheet.octopart.com/C0805C106K9RACTU-KEMET-datasheet-157246124.pdf?src-supplier=Digikey; ComponentLink8Description: http://datasheet.octopart.com/C0805C106K9RACTU-KEMET-datasheet-157246124.pdf?src-supplier=Digikey; ComponentLink9URL: https://api.kemet.com/component-edge/download/datasheet/C0805C106K9RACTU.pdf?src-supplier=Digikey; ComponentLink9Description: https://api.kemet.com/component-edge/download/datasheet/C0805C106K9RACTU.pdf?src-supplier=Digikey; ComponentLink10URL: http://www.farnell.com/datasheets/2745931.pdf?src-supplier=Element14; ComponentLink10Description: http://www.farnell.com/datasheets/2745931.pdf?src-supplier=Element14; ComponentLink11URL: https://datasheet.octopart.com/C0805C106K9RACTU-Kemet-datasheet-66076756.pdf?src-supplier=Element14; ComponentLink11Description: https://datasheet.octopart.com/C0805C106K9RACTU-Kemet-datasheet-66076756.pdf?src-supplier=Element14; ComponentLink12URL: http://datasheet.octopart.com/C0805C106K9RACTU-KEMET-datasheet-157246124.pdf?src-supplier=Rs; ComponentLink12Description: http://datasheet.octopart.com/C0805C106K9RACTU-KEMET-datasheet-157246124.pdf?src-supplier=Rs; ComponentLink13URL: http://www.farnell.com/datasheets/1791936.pdf?src-supplier=Newark; ComponentLink13Description: http://www.farnell.com/datasheets/1791936.pdf?src-supplier=Newark; ComponentLink14URL: http://datasheet.octopart.com/C0805C106K9RACTU-KEMET-datasheet-157246124.pdf?src-supplier=Electro+Sonic; ComponentLink14Description: http://datasheet.octopart.com/C0805C106K9RACTU-KEMET-datasheet-157246124.pdf?src-supplier=Electro+Sonic; ComponentLink15URL: https://datasheet.octopart.com/C0805C106K9RACTU-KEMET-datasheet-157246124.pdf?src-supplier=TME; ComponentLink15Description: https://datasheet.octopart.com/C0805C106K9RACTU-KEMET-datasheet-157246124.pdf?src-supplier=TME; ComponentLink16URL: http://datasheet.octopart.com/C0805C106K9RACTU-KEMET-datasheet-157246124.pdf?src-supplier=NAC+Semi; ComponentLink16Description: http://datasheet.octopart.com/C0805C106K9RACTU-KEMET-datasheet-157246124.pdf?src-supplier=NAC+Semi
C36 = C0805C104K4RACAUTO: 0.1uF/16V ±10% X7R 0805 (2012METRIC) Ceramic Capacitor SMD Auto X7R; Mfr_Name: Kemet; Material: 4241ConductorMaterial; Value: 100nF; Temperature Coefficient: 30ppm/°C; Voltage Rating: 16V; Supplier: Digikey; Supplier Part Number: 399-C0805C104K4RACAUTOCT-ND; Manufacturer: KEMET; Manufacturer Part Number: C0805C104K4RACAUTO; RoHS: Yes; Category: Ceramic Capacitors; Stock: 27573; Pricing: 1=0.19, 10=0.108, 100=0.0672, 1000=0.04624 (USD); Case/Package: 0805; Dielectric Material: 4241ConductorMaterial; Min Operating Temperature: -55°C; Max Operating Temperature: 125°C; Tolerance: 10%; Packaging: Tape and Reel; Dielectric: X7R; Voltage Rating (DC): 16V; Length: 2mm; Depth: 1.25mm; RoHS Compliant: Yes
J7 = MSD-4-A: Micro SD Card Connector, 9 Positions, Connector and Ejector, Push In, Auto Eject Out, Surface Mount, 1.8 mm Height Above Board, Gold Flash; MF: Same Sky; SnapEDA_Link: https://www.snapeda.com/parts/MSD-4-A/Same+Sky/view-part/?ref=snap; Package: None; Value: *; MP: MSD-4-A; Check_prices: https://www.snapeda.com/parts/MSD-4-A/Same+Sky/view-part/?ref=eda
R44-R50 = ERJ-3EKF33R0V: Res Thick Film 0603 33 Ohm 1% 0.1W ±100ppm/°C Molded SMD Punched Carrier T/R; Mfr_Name: Panasonic; Power Rating: 100mW; Voltage Rating: 75V; Supplier: Digikey; Supplier Part Number: P33.0HCT-ND; Manufacturer: Panasonic; Manufacturer Part Number: ERJ-3EKF33R0V; RoHS: Yes; Category: Chip SMD Resistors; Stock: 430721; Pricing: 1=0.1, 10=0.035, 100=0.0177, 1000=0.01014, 2500=0.00888 (USD); Mounting Technology: Surface Mount; Case/Package: 0603; Pins: 2; Case Code (Metric): 1608; Case Code (Imperial): 0603; Contact Plating: Tin; Min Operating Temperature: -55°C; Max Operating Temperature: 155°C; Value: 33R; Tolerance: 1%; Packaging: Tape and Reel; Package Quantity: 1; Resistor Type: Thick Film; Number of Terminations: 2; Temperature Coefficient: 100ppm/°C; Termination: SMD/SMT; Max Power Dissipation: 100mW; Voltage Rating (DC): 75V; Features: Automotive AEC-Q200; Series: ERJ; Construction: Rectangular; Resistance Tolerance: 1%; Length: 1.6mm; Width: 0.8mm; Height: 0.022inch; Depth: 0.8mm; Radiation Hardening: No; Reach SVHC Compliant: No; Military Standard: Not; Lead Free: Lead Free; RoHS Compliant: Yes; ComponentLink1URL: https://datasheet.ciiva.com/5917/aoa0000ce2-5917831.pdf?src-supplier=Farnell; ComponentLink1Description: https://datasheet.ciiva.com/5917/aoa0000ce2-5917831.pdf?src-supplier=Farnell; ComponentLink2URL: https://datasheet.ciiva.com/48531/aoa0000ce2-48531007.pdf?src-supplier=Avnet; ComponentLink2Description: https://datasheet.ciiva.com/48531/aoa0000ce2-48531007.pdf?src-supplier=Avnet; ComponentLink3URL: https://datasheet.ciiva.com/30250/aoa0000ce2-30250862.pdf?src-supplier=Onlinecomponents.com; ComponentLink3Description: https://datasheet.ciiva.com/30250/aoa0000ce2-30250862.pdf?src-supplier=Onlinecomponents.com; ComponentLink4URL: https://datasheet.ciiva.com/16778/70260748-16778478.pdf?src-supplier=Allied+Electronics; ComponentLink4Description: https://datasheet.ciiva.com/16778/70260748-16778478.pdf?src-supplier=Allied+Electronics; ComponentLink5URL: https://datasheet.ciiva.com/16781/70260748-16781237.pdf?src-supplier=Allied+Electronics; ComponentLink5Description: https://datasheet.ciiva.com/16781/70260748-16781237.pdf?src-supplier=Allied+Electronics; ComponentLink6URL: https://datasheet.ciiva.com/22673/1678782-22673288.pdf?src-supplier=Element14; ComponentLink6Description: https://datasheet.ciiva.com/22673/1678782-22673288.pdf?src-supplier=Element14; ComponentLink7URL: https://datasheet.ciiva.com/24026/aoa0000ce2-24026635.pdf?src-supplier=Mouser; ComponentLink7Description: https://datasheet.ciiva.com/24026/aoa0000ce2-24026635.pdf?src-supplier=Mouser; ComponentLink8URL: https://datasheet.ciiva.com/22687/1678782-22687390.pdf?src-supplier=Element14; ComponentLink8Description: https://datasheet.ciiva.com/22687/1678782-22687390.pdf?src-supplier=Element14; ComponentLink9URL: https://datasheet.ciiva.com/7836/aoa0000ce2-7836503.pdf?src-supplier=Element14; ComponentLink9Description: https://datasheet.ciiva.com/7836/aoa0000ce2-7836503.pdf?src-supplier=Element14; ComponentLink10URL: https://datasheet.ciiva.com/7836/426256-7836821.pdf?src-supplier=Element14; ComponentLink10Description: https://datasheet.ciiva.com/7836/426256-7836821.pdf?src-supplier=Element14
U18 U19 = TPD4E02B04DQAR: TVS DIODE 3.6V 8.8V 10USON / 4-Channel ESD Protection Diode for USB Type-C and HDMI 2.0; Mfr_Name: Texas Instruments; CompType: IC; Number of Bidirectional Channels: 4; Min Breakdown Voltage: 5.5V; Peak Pulse Power: 17W; Power Line Protection: No; Peak Pulse Current: 5A; Interface: USB,HDMI; Diode Type: ZENER; Direction: 211Direction; Breakdown Voltage: 6.4V; TYPE: TYPE; RefDes: RefDes; Application_BuildNumber: *; PartNumber: TPD4E02B04DQAR; PackageReference: DQA0010A; MountType: SMT; RoHS: Y; Manufacturer: Texas Instruments; Supplier: Digikey; Supplier Part Number: 296-43875-1-ND; Manufacturer Part Number: TPD4E02B04DQAR; Category: Integrated Circuits (ICs); Mounting Technology: Surface Mount; Pins: 10; Min Operating Temperature: -40°C; Max Operating Temperature: 125°C; Packaging: Cut Tape; Reverse Standoff Voltage: 3.6V; Operating Supply Voltage: 3.6V; Number of Channels: 4; Series: -; Length: 2.5mm; Width: 1mm; Height: 550um; Thickness: 500um; Reach SVHC Compliant: No; Lead Free: Lead Free; RoHS Compliant: Yes; ComponentLink1URL: http://www.ti.com/lit/ds/symlink/tpd4e02b04.pdf?src-supplier=Digikey; ComponentLink1Description: http://www.ti.com/lit/ds/symlink/tpd4e02b04.pdf?src-supplier=Digikey; ComponentLink2URL: http://www.ti.com/lit/ds/symlink/tpd4e02b04.pdf?src-supplier=Farnell; ComponentLink2Description: http://www.ti.com/lit/ds/symlink/tpd4e02b04.pdf?src-supplier=Farnell; ComponentLink3URL: http://www.ti.com/lit/ds/symlink/tpd4e02b04.pdf?src-supplier=Newark; ComponentLink3Description: http://www.ti.com/lit/ds/symlink/tpd4e02b04.pdf?src-supplier=Newark; ComponentLink4URL: http://www.ti.com/general/docs/lit/getliterature.tsp?genericPartNumber=TPD4E02B04&amp;&amp;fileType=pdf&src-supplier=Element14; ComponentLink4Description: http://www.ti.com/general/docs/lit/getliterature.tsp?genericPartNumber=TPD4E02B04&amp;&amp;fileType=pdf&src-supplier=Element14